# EAGLE design robotarmcontrollerboard (EAGLE 7.5.0)
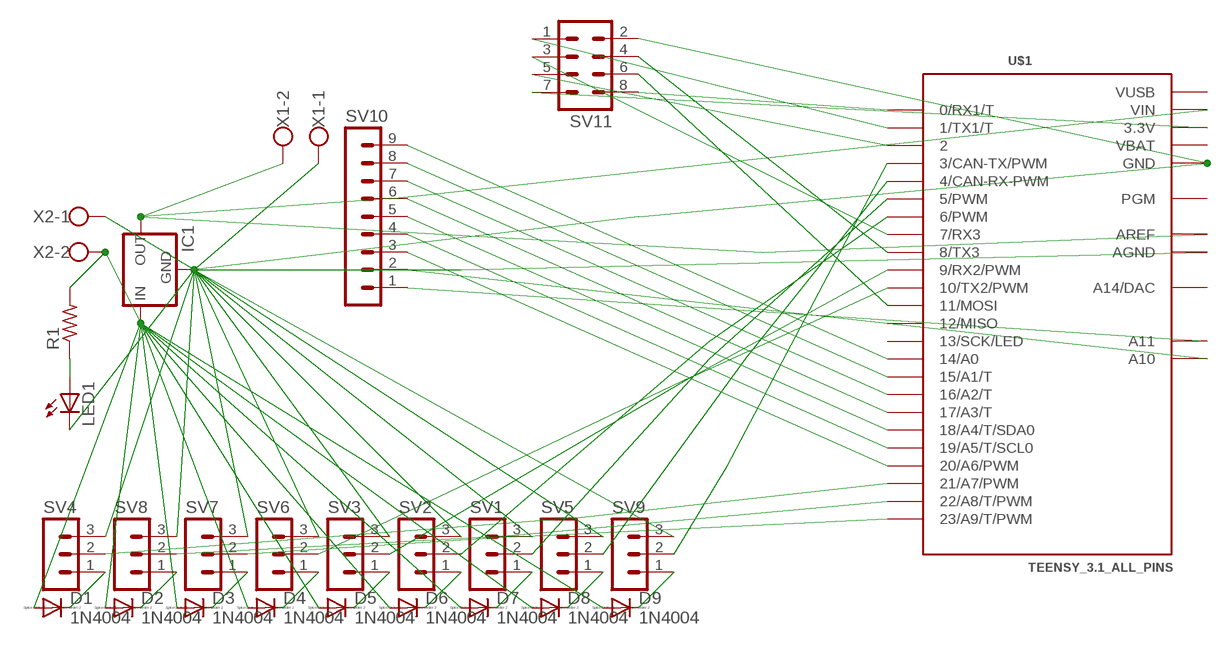
[diagram p0: schematic, sheet 1]

## Parts
D1  1N4004  [DO41-10]
D2  1N4004  [DO41-10]
D3  1N4004  [DO41-10]
D4  1N4004  [DO41-10]
D5  1N4004  [DO41-10]
D6  1N4004  [DO41-10]
D7  1N4004  [DO41-10]
D8  1N4004  [DO41-10]
D9  1N4004  [DO41-10]
IC1  78XXL  [78XXL]
LED1  LED3MM  [LED3MM]
R1  R-US_0204/7  [0204/7]
SV1  MA03-1  [MA03-1]
SV2  MA03-1  [MA03-1]
SV3  MA03-1  [MA03-1]
SV4  MA03-1  [MA03-1]
SV5  MA03-1  [MA03-1]
SV6  MA03-1  [MA03-1]
SV7  MA03-1  [MA03-1]
SV8  MA03-1  [MA03-1]
SV9  MA03-1  [MA03-1]
SV10  MA09-1W  [MA09-1W]
SV11  MA04-2  [MA04-2]
U$1  TEENSY_3.1_ALL_PINS  [TEENSY3-ALL_PINS]
X1  W237-102  [W237-102]
X2  W237-102  [W237-102]

## Nets
N$1: SV10.9 U$1.14/A0
N$2: SV10.8 U$1.15/A1(15/A1/T)
N$3: SV10.7 U$1.16/A2(16/A2/T)
N$4: SV10.6 U$1.17/A3(17/A3/T)
N$5: SV10.5 U$1.18/A4(18/A4/T/SDA0)
N$6: SV10.4 U$1.19/A5(19/A5/T/SCL0)
N$7: SV10.3 U$1.20/A6(20/A6/PWM)
N$8: SV10.2 U$1.A10
N$9: SV10.1 U$1.A11
N$10: SV9.2 U$1.3(3/CAN-TX/PWM)
N$11: SV5.2 U$1.4(4/CAN-RX-PWM)
N$12: SV1.2 U$1.5(5/PWM)
N$13: SV2.2 U$1.6(6/PWM)
N$14: SV3.2 U$1.9(9/RX2/PWM)
N$15: SV6.2 U$1.10(10/TX2/PWM)
N$16: SV7.2 U$1.23/A9(23/A9/T/PWM)
N$17: SV8.2 U$1.22/A8(22/A8/T/PWM)
N$18: SV4.2 U$1.21/A7(21/A7/PWM)
N$19: IC1.GND LED1.K(C) SV1.3 SV2.3 SV3.3 SV4.3 SV5.3 SV6.3 SV7.3 SV8.3 SV9.3 SV11.2 U$1.AGND U$1.GND U$1.GND1(GND) X1.1 X2.1
N$20: IC1.OUT U$1.AREF U$1.VIN X1.2
N$21: D1.C SV4.1
N$22: D2.C SV8.1
N$23: D3.C SV7.1
N$24: D4.C SV6.1
N$25: D5.C SV3.1
N$26: D6.C SV2.1
N$27: D7.C SV1.1
N$28: D8.C SV5.1
N$29: D9.C SV9.1
N$30: LED1.A R1.1
N$31: SV11.1 U$1.1(1/TX1/T)
N$32: D1.A D2.A D3.A D4.A D5.A D6.A D7.A D8.A D9.A IC1.IN R1.2 X2.2
N$33: SV11.7 U$1.3.3V U$1.3.3V1(3.3V)
N$34: SV11.5 U$1.2
N$35: SV11.4 U$1.8(8/TX3)
N$36: SV11.6 U$1.11(11/MOSI)
N$37: SV11.3 U$1.7(7/RX3)
N$38: SV11.8 U$1.0(0/RX1/T)
Unconnected: U$1.12(12/MISO) U$1.13(13/SCK/LED) U$1.PGM U$1.RESET/DAC(A14/DAC)

## Power pins joined to a net without a drawn wire
VBAT: U$1.VBAT
VUSB: U$1.VUSB

## Library data of the parts
D1-D9 = diode:1N4004: DIODE general purpose rectifier, 1 A
IC1 = v-reg:78XXL: VOLTAGE REGULATOR
LED1 = led:LED: LED OSRAM: - CHIPLED LG R971, LG N971, LY N971, LG Q971, LY Q971, LO R971, LY R971 LH N974, LH R974 LS Q976, LO Q976, LY Q976 LO Q996 - Hyper CHIPLED LW Q18S LB Q993, LB Q99A, LB R99A - SideLED LS A670, LO A670, LY A670, LG A670, LP A670 LB A673, LV A673, LT A673, LW A673 LH A674 LY A675 LS A676, LA A676, LO A676, LY A676, LW A676 LS A679, LY A679, LG A679 - Hyper Micro SIDELED® LS Y876, LA Y876, LO Y876, LY Y876 LT Y87S - SmartLED LW L88C, LW L88S LB L89C, LB L89S, LG L890 LS L89K, LO L89K, LY L89K LS L896, LA L896, LO L896, LY L896 - TOPLED LS T670, LO T670, LY T670, LG T670, LP T670 LSG T670, LSP T670, LSY T670, LOP T670, LYG T670 LG T671, LOG T671, LSG T671 LB T673, LV T673, LT T673, LW T673 LH T674 LS T676, LA T676, LO T676, LY T676, LB T676, LH T676, LSB T676, LW T676 LB T67C, LV T67C, LT T67C, LS T67K, LO T67K, LY T67K, LW E67C LS E67B, LA E67B, LO E67B, LY E67B, LB E67C, LV E67C, LT E67C LW T67C LS T679, LY T679, LG T679 LS T770, LO T770, LY T770, LG T770, LP T770 LB T773, LV T773, LT T773, LW T773 LH T774 LS E675, LA E675, LY E675, LS T675 LS T776, LA T776, LO T776, LY T776, LB T776 LHGB T686 LT T68C, LB T68C - Hyper Mini TOPLED® LB M676 - Mini TOPLED Santana® LG M470 LS M47K, LO M47K, LY M47K Source: http://www.osram.convergy.de LUXEON: - LUMILED® LXK2-PW12-R00, LXK2-PW12-S00, LXK2-PW14-U00, LXK2-PW14-V00 LXK2-PM12-R00, LXK2-PM12-S00, LXK2-PM14-U00 LXK2-PE12-Q00, LXK2-PE12-R00, LXK2-PE12-S00, LXK2-PE14-T00, LXK2-PE14-U00 LXK2-PB12-K00, LXK2-PB12-L00, LXK2-PB12-M00, LXK2-PB14-N00, LXK2-PB14-P00, LXK2-PB14-Q00 LXK2-PR12-L00, LXK2-PR12-M00, LXK2-PR14-Q00, LXK2-PR14-R00 LXK2-PD12-Q00, LXK2-PD12-R00, LXK2-PD12-S00 LXK2-PH12-R00, LXK2-PH12-S00 LXK2-PL12-P00, LXK2-PL12-Q00, LXK2-PL12-R00 Source: www.luxeon.com KINGBRIGHT: KA-3528ASYC Source: www.kingbright.com
R1 = resistor:R-US_: RESISTOR, American symbol
SV1-SV9 = con-lstb:MA03-1: PIN HEADER; OC_FARNELL: unknown; OC_NEWARK: unknown
SV10 = con-lstb:MA09-1W: PIN HEADER; OC_FARNELL: unknown; OC_NEWARK: unknown
SV11 = con-lstb:MA04-2: PIN HEADER; OC_FARNELL: unknown; OC_NEWARK: unknown
U$1 = Teensy_3_and_LC_Series_Boards_v1.1:TEENSY_3.1_ALL_PINS: Footprint for Teensy 3.1 or 3.2 board using all through-holes, i.e. the entire perimeter plus the 4 through-holes inboard (A10,A11,AREF, VUSB)
X1 X2 = con-wago-500:W237-102: WAGO SCREW CLAMP; MPN: 237-102; OC_FARNELL: unknown; OC_NEWARK: 70K9898

## Board
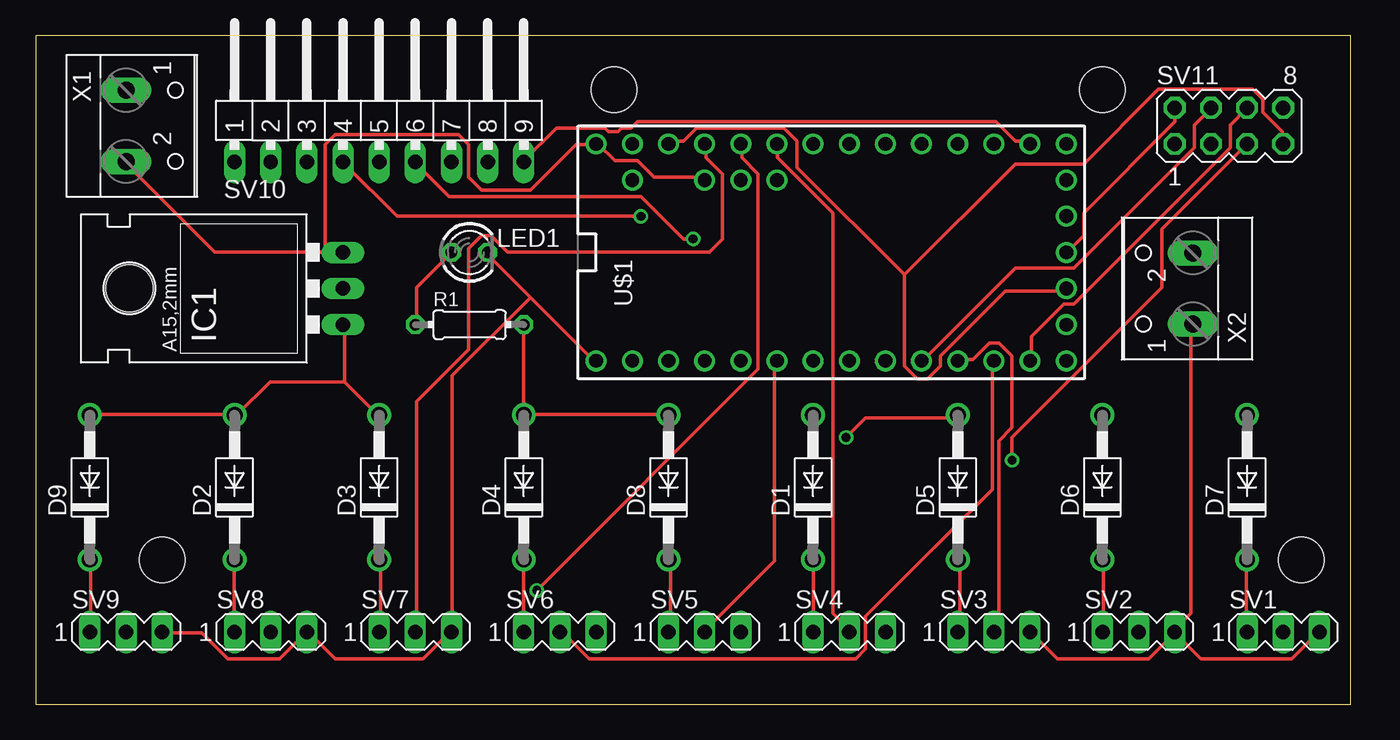
[diagram p1: board, top side]
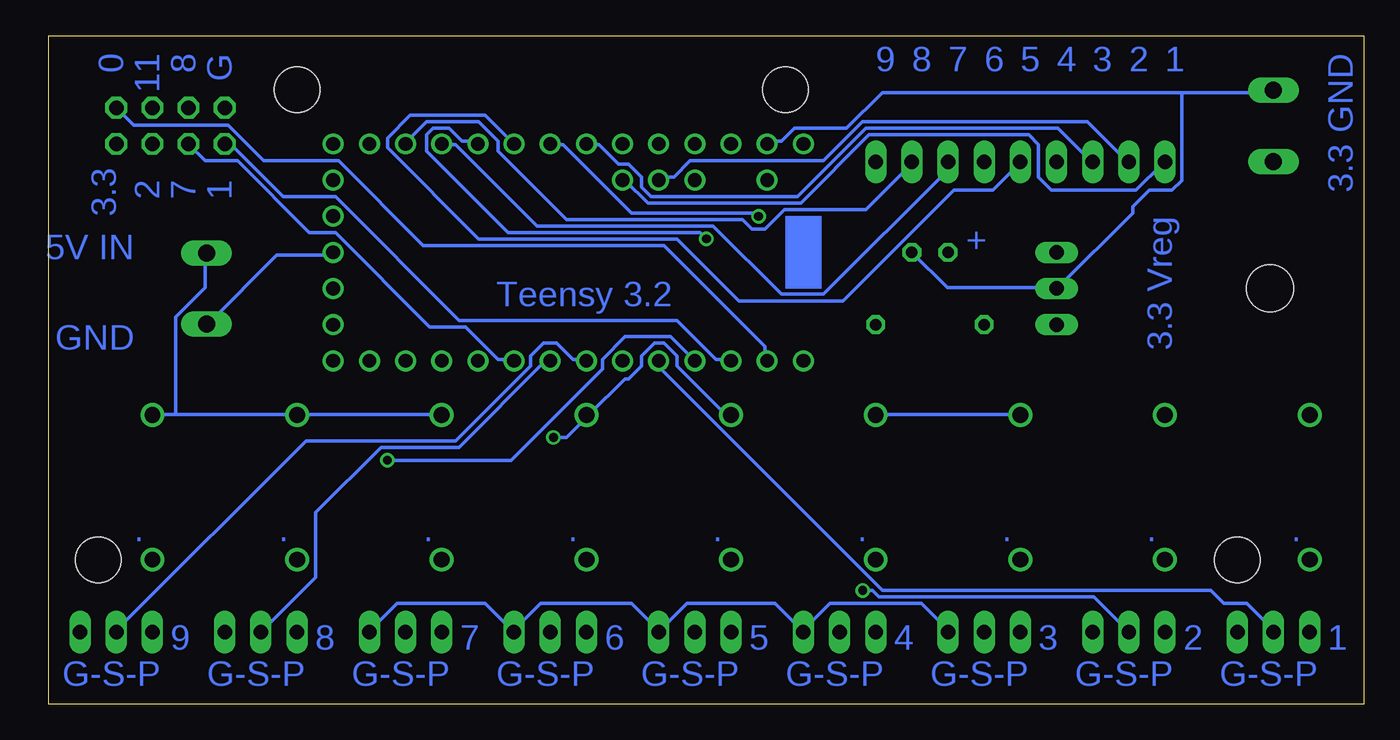
[diagram p2: board, bottom side, seen from below]

Size 92.38 x 46.98 mm. Coordinates in mm from the lower left corner, seen from the top.
Outline: 0,0 92.38,0 92.38,46.98 0,46.98 0,0
Copper layers (1*16): Top 0.035mm / dielectric 1.5mm / Bottom 0.035mm
Design rules "default": minimum track width 10mil, minimum drill 24mil, track to track 8mil, track to pad 8mil, pad to pad 8mil, via to via 8mil, smd to smd 8mil, copper to edge 40mil, drill to drill 8mil, minimum pad ring 10mil, minimum via ring 8mil, stop-mask expansion 4mil, vias tented up to drill 0mil, thermal gap 10mil
Holes 3.2 mm at 40.64,43.18 74.93,43.18 8.89,10.16 88.9,10.16

### Footprints (pad centres in the part's own frame; a part is rotated, then mirrored left to right if it is on the bottom)
DO41-10 = drill 1.118: A 5.08,0; C -5.08,0
78XXL = drill 1.016 long: GND 0,-3.81; IN -2.54,-3.81; OUT 2.54,-3.81 | hole 3.302: 0,11.176
LED3MM = drill 0.813 octagon: A -1.27,0; K 1.27,0
0204/7 = drill 0.813 octagon: 1 -3.81,0; 2 3.81,0
MA03-1 = drill 1.016 long: 1 -2.54,0; 2 0,0; 3 2.54,0
MA09-1W = drill 1.016 long: 1 -10.16,0; 2 -7.62,0; 3 -5.08,0; 4 -2.54,0; 5 0,0; 6 2.54,0; 7 5.08,0; 8 7.62,0; 9 10.16,0
MA04-2 = drill 1.016 octagon: 1 -3.81,-1.27; 2 -3.81,1.27; 3 -1.27,-1.27; 4 -1.27,1.27; 5 1.27,-1.27; 6 1.27,1.27; 7 3.81,-1.27; 8 3.81,1.27
TEENSY3-ALL_PINS = drill 0.965: 0 -7.62,13.97; 1 -7.62,11.43; 2 -7.62,8.89; 3 -7.62,6.35; 3.3V 7.62,11.43; 3.3V1 -2.54,-16.51; 4 -7.62,3.81; 5 -7.62,1.27; 6 -7.62,-1.27; 7 -7.62,-3.81; 8 -7.62,-6.35; 9 -7.62,-8.89; 10 -7.62,-11.43; 11 -7.62,-13.97; 12 -7.62,-16.51; 13 7.62,-16.51; 14/A0 7.62,-13.97; 15/A1 7.62,-11.43; 16/A2 7.62,-8.89; 17/A3 7.62,-6.35; 18/A4 7.62,-3.81; 19/A5 7.62,-1.27; 20/A6 7.62,1.27; 21/A7 7.62,3.81; 22/A8 7.62,6.35; 23/A9 7.62,8.89; A10 5.08,6.35; A11 5.08,3.81; AGND 7.62,13.97; AREF 5.08,8.89; GND -7.62,16.51; GND1 0,-16.51; PGM 2.54,-16.51; RESET/DAC 5.08,-16.51; VBAT -5.08,-16.51; VIN 7.62,16.51; VUSB 5.08,13.97
W237-102 = drill 1.194 long: 1 -2.5,-1.27; 2 2.5,-1.27

### Placement (x,y rotation side)
D1  54.61,15.24 90 top
D2  13.97,15.24 90 top
D3  24.13,15.24 90 top
D4  34.29,15.24 90 top
D5  64.77,15.24 90 top
D6  74.93,15.24 90 top
D7  85.09,15.24 90 top
D8  44.45,15.24 90 top
D9  3.81,15.24 90 top
IC1  17.78,29.21 90 top
LED1  30.48,31.75 0 top
R1  30.48,26.67 0 top
SV1  87.63,5.08 0 top
SV2  77.47,5.08 0 top
SV3  67.31,5.08 0 top
SV4  57.15,5.08 0 top
SV5  46.99,5.08 0 top
SV6  36.83,5.08 0 top
SV7  26.67,5.08 0 top
SV8  16.51,5.08 0 top
SV9  6.35,5.08 0 top
SV10  24.13,38.1 0 top
SV11  83.82,40.64 0 top
U$1  55.88,31.75 90 top
X1  7.62,40.64 270 top
X2  80.01,29.21 90 top

### Tracks (layer width: path | path; a pad name or v marks a point on that pad's centre or on a via)
N$1
  Top 0.254: U$1.14/A0 69.72,39.55 68.81,39.55 67.44,40.92 42.29,40.92 41.83,40.46 41.15,40.46 40.92,40.23 40.23,40.23 40.01,40.46 36.58,40.46 34.29,38.18 SV10.9
N$2
  Bottom 0.254: U$1.15/A1 67.21,39.55 65.84,40.92 62.18,40.92 60.81,39.55 60.81,38.86 56.01,34.06 43.66,34.06 42.98,33.38 42.06,33.38 40.69,34.75 34.98,34.75 31.77,37.95 SV10.8
N$3
  Bottom 0.254: U$1.16/A2 64.69,39.32 63.78,39.32 58.06,33.6 45.72,33.6 40.92,28.8 37.95,28.8 29.26,37.49 29.26,37.95 SV10.7
N$4  (via drill 0.61)
  Top 0.254: v46.18,32.69 45.49,32.69 42.52,35.66 29.03,35.66 26.75,37.95 SV10.6
  Bottom 0.254: v46.18,32.69 46.63,33.15 60.12,33.15 65.84,38.86 65.84,40.01 65.38,40.46 64.24,40.46 63.32,39.55 62.41,39.55 U$1.17/A3
N$5
  Bottom 0.254: U$1.18/A4 59.89,39.55 61.72,41.38 66.98,41.38 68.58,39.78 68.58,39.09 62.18,32.69 48.23,32.69 43.89,28.35 36.58,28.35 28.8,36.12 26.06,36.12 24.23,37.95 SV10.5
N$6  (via drill 0.61)
  Top 0.254: v42.52,34.29 25.38,34.29 21.72,37.95 SV10.4
  Bottom 0.254: v42.52,34.29 42.75,34.52 51.44,34.52 56.24,39.32 57.15,39.32 U$1.19/A5
N$7
  Bottom 0.254: U$1.20/A6 54.41,39.32 53.72,39.32 52.35,37.95 51.66,37.95 50.75,37.03 50.75,36.35 50.06,35.66 39.78,35.66 34.98,40.46 21.49,40.46 19.2,38.18 SV10.3
N$8
  Bottom 0.254: U$1.A10 49.38,37.03 48.46,37.03 47.32,38.18 37.95,38.18 35.2,40.92 19.43,40.92 16.69,38.18 SV10.2
N$9
  Bottom 0.254: U$1.A11 51.89,36.8 50.29,35.2 39.55,35.2 34.75,40.01 23.55,40.01 22.86,39.32 22.86,37.03 21.95,36.12 16,36.12 14.17,37.95 SV10.1
N$10
  Bottom 0.254: U$1.3 49.38,24 49.38,23.55 33.83,8 10.74,8 9.83,7.09 8.23,7.09 6.4,5.26 SV9.2
N$11
  Top 0.254: U$1.4 51.89,24 51.89,10.06 47.09,5.26 SV5.2
N$12
  Bottom 0.254: U$1.5 54.63,24.23 55.55,24.23 56.69,25.38 57.61,25.38 58.52,24.46 58.52,23.77 63.78,18.52 74.3,18.52 87.55,5.26 SV1.2
N$13
  Bottom 0.254: U$1.6 57.15,24 57.61,24 63.55,18.06 69.04,18.06 73.61,13.49 73.61,8.91 77.27,5.26 SV2.2
N$14
  Top 0.254: U$1.9 64.92,24.23 65.84,24.23 66.98,25.38 67.67,25.38 68.58,24.46 68.58,19.43 67.67,18.52 67.67,5.49 67.44,5.26 SV3.2
N$15
  Top 0.254: U$1.10 67.21,24 67.21,15.09 58.29,6.17 58.29,3.89 57.61,3.2 38.86,3.2 37.03,5.03 SV6.2
N$16
  Top 0.254: U$1.23/A9 47.09,39.32 47.09,38.41 48.23,37.26 48.23,32.69 47.32,31.77 33.15,31.77 32,32.92 31.32,32.92 30.4,32 30.4,24.92 26.75,21.26 26.75,5.26 SV7.2
N$17  (via drill 0.61)
  Top 0.254: v35.2,8 50.75,23.55 50.75,37.26 49.61,38.41 49.61,39.32 U$1.22/A8
  Bottom 0.254: v35.2,8 34.52,8 34.06,7.54 18.97,7.54 SV8.2
N$18
  Top 0.254: U$1.21/A7 52.12,39.32 52.12,38.41 56.01,34.52 56.01,6.4 57.15,5.26 SV4.2
N$19
  Top 0.254: 34.75,28.57 39.32,24 U$1.GND | 34.75,28.57 31.77,31.55 LED1.K | SV9.3 8.91,5.03 11.66,5.03 13.49,3.2 17.14,3.2 18.97,5.03 SV8.3 19.2,5.03 21.03,3.2 27.2,3.2 29.03,5.03 SV7.3 29.26,5.26 29.26,23.09 34.75,28.57 | SV11.2 80.01,40.92 73.61,34.52 73.61,32.92 72.47,31.77 U$1.GND1 | 80.01,5.03 78.18,3.2 71.78,3.2 69.95,5.03 SV3.3 | 80.01,5.03 81.84,3.2 88.24,3.2 90.07,5.03 SV1.3 | 80.01,5.03 SV2.3 80.01,5.26 81.15,6.4 81.15,26.52 X2.1
  Bottom 0.254: LED1.K 29.26,29.26 21.72,29.26 IC1.GND 21.49,29.26 16.23,34.52 16.23,34.98 15.09,36.12 13.49,36.12 12.8,36.8 12.8,42.98 | 12.8,42.98 6.4,42.98 X1.1 | 12.8,42.98 33.83,42.98 36.35,40.46 40.01,40.46 40.92,39.55 41.83,39.55 U$1.AGND | SV7.3 29.26,5.26 31.09,7.09 37.49,7.09 39.32,5.26 SV6.3 41.38,7.09 47.55,7.09 49.38,5.26 SV5.3 49.61,5.26 51.44,7.09 57.84,7.09 59.66,5.26 SV4.3 59.89,5.26 61.72,7.09 67.89,7.09 69.72,5.26 SV3.3 | U$1.GND1 72.47,31.55 76.35,31.55 81.15,26.75 X2.1
N$20
  Top 0.254: U$1.AREF 46.86,37.03 43.43,37.03 42.29,38.18 40.69,38.18 39.55,39.32 U$1.VIN 39.32,39.32 37.95,39.32 34.75,36.12 31.32,36.12 30.4,37.03 30.4,39.32 29.72,40.01 21.03,40.01 20.34,39.32 20.34,31.77 | 20.34,31.77 12.57,31.77 6.4,37.95 X1.2 | 20.34,31.77 21.49,31.77 IC1.OUT 20.34,31.77
N$21
  Top 0.254: SV4.1 54.63,5.26 54.63,10.06 D1.C
N$22
  Top 0.254: SV8.1 13.95,5.26 13.95,10.06 D2.C
N$23
  Top 0.254: SV7.1 24.23,5.26 24.23,10.06 D3.C
N$24
  Top 0.254: D4.C SV6.1
N$25
  Top 0.254: SV3.1 64.92,5.26 64.92,10.06 D5.C
N$26
  Top 0.254: SV2.1 74.98,5.26 74.98,10.06 D6.C
N$27
  Top 0.254: SV1.1 85.04,5.26 85.04,10.06 D7.C
N$28
  Top 0.254: SV5.1 44.58,5.26 44.58,10.06 D8.C
N$29
  Top 0.254: SV9.1 3.89,5.26 3.89,10.06 D9.C
N$30
  Top 0.254: R1.1 26.75,26.75 26.75,29.26 29.03,31.55 LED1.A
N$31
  Bottom 0.254: U$1.1 44.58,24.23 45.49,24.23 48.23,26.98 63.55,26.98 72.24,35.66 75.89,35.66 79.55,39.32 80.01,39.32 SV11.1
N$32  (via drill 0.61)
  Top 0.254: 34.29,20.34 R1.2 | 34.29,20.34 44.35,20.34 D8.A | 34.29,20.34 D4.A | 21.72,22.63 21.72,26.52 IC1.IN | 21.72,22.63 24,20.34 D3.A | D9.A 3.89,20.34 13.95,20.34 D2.A 14.17,20.34 16.46,22.63 21.72,22.63 | v56.92,18.75 58.29,20.12 64.69,20.12 D5.A
  Bottom 0.254: D5.A 64.92,20.34 74.75,20.34 D6.A 74.98,20.34 83.44,20.34 | 83.44,20.34 85.04,20.34 D7.A | 83.44,20.34 83.44,27.2 81.38,29.26 81.38,31.55 X2.2 | D8.A 44.58,20.12 48.23,23.77 48.23,24.46 49.15,25.38 49.84,25.38 50.75,24.46 50.75,23.77 51.66,22.86 51.89,22.86 54.41,20.34 D1.A 54.63,20.12 56.01,18.75 v56.92,18.75 | D4.A 34.29,20.34 24.23,20.34 D3.A
N$33
  Top 0.254: 61.04,30.18 53.49,37.72 53.49,39.55 52.58,40.46 46.41,40.46 45.49,39.55 44.58,39.55 U$1.3.3V | 61.04,30.18 61.04,23.77 61.95,22.86 62.64,22.86 63.55,23.77 63.55,24.46 68.12,29.03 72.24,29.03 U$1.3.3V1 | 61.04,30.18 68.81,37.95 73.61,37.95 78.87,43.2 85.5,43.2 86.18,42.52 86.18,41.6 87.55,40.23 87.55,39.55 SV11.7
N$34  (via drill 0.61)
  Top 0.254: v68.58,17.14 68.58,18.75 79.1,29.26 79.1,33.38 SV11.5
  Bottom 0.254: U$1.2 48.69,25.83 51.89,25.83 53.49,24.23 53.49,23.55 59.89,17.14 v68.58,17.14
N$35
  Top 0.254: U$1.8 62.41,24.23 68.81,30.63 72.92,30.63 81.38,39.09 81.38,40.69 82.53,41.83 SV11.4
N$36
  Top 0.254: U$1.11 69.95,24.23 69.95,25.83 72.24,28.12 72.92,28.12 83.9,39.09 83.9,40.69 85.04,41.83 SV11.6
N$37
  Bottom 0.254: U$1.7 59.89,24.23 60.81,24.23 63.09,26.52 65.61,26.52 72.24,33.15 74.07,33.15 79.1,38.18 81.38,38.18 82.53,39.32 SV11.3
N$38
  Bottom 0.254: SV11.8 86.41,40.69 79.78,40.69 77.27,38.18 72.01,38.18 66.06,32.23 49.15,32.23 42.06,25.15 42.06,24.23 U$1.0
(copper drawn outside any net)
  shapes: Bottom area x1

### Text on the board
Bottom: GND | G | 8 | 11 | 0 | 1 | 2 | 3 | 4 | 5 | 6 | 7 | 8 | 9 | 3.3 | 1 | 7 | 2 | 3.3 Vreg | 3.3 | 5V IN | + | Teensy 3.2 | GND | . | . | . | . | . | . | . | . | . | 1 | 2 | 3 | 4 | 5 | 6 | 7 | 8 | 9 | G-S-P | G-S-P | G-S-P | G-S-P | G-S-P | G-S-P | G-S-P | G-S-P | G-S-P